# Altium schematic sheet Sheet2.SchDoc
size A4; SheetNumber: 1; SheetTotal: 2
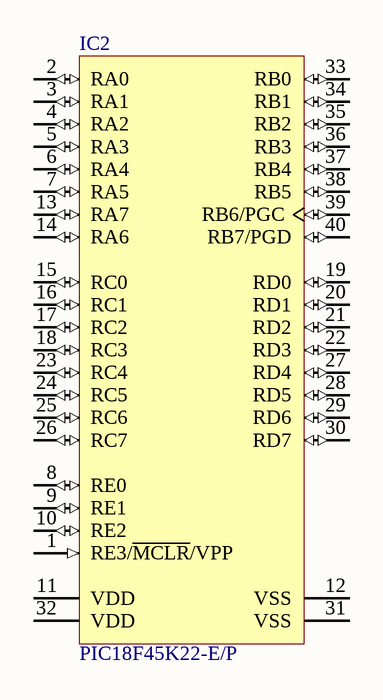
[diagram p0: Sheet2.SchDoc]

## Parts
IC2  PIC18F45K22-E/P  [MCHP-PDIP-P40]

## Nets

Not connected (* = marked no-connect by the designer): IC2 1(RE3/~{MCLR}/VPP) 2(RA0) 3(RA1) 4(RA2) 5(RA3) 6(RA4) 7(RA5) 8(RE0) 9(RE1) 10(RE2) 11(VDD) 12(VSS) 13(RA7) 14(RA6) 15(RC0) 16(RC1) 17(RC2) 18(RC3) 19(RD0) 20(RD1) 21(RD2) 22(RD3) 23(RC4) 24(RC5) 25(RC6) 26(RC7) 27(RD4) 28(RD5) 29(RD6) 30(RD7) 31(VSS) 32(VDD) 33(RB0) 34(RB1) 35(RB2) 36(RB3) 37(RB4) 38(RB5) 39(RB6/PGC) 40(RB7/PGD)

## Library data of the parts
IC2 = CMP-0116-01375-1: Low-Power, High-Performance Microcontroller with XLP Technology, 64 MHz, 35 I/O, -40 to 125 degC, 40-pin PDIP (P40), Tube; Manufacturer: Microchip; # of A/D Channels: 28; Max. CPU Speed MHz: 64; Operation Voltage Range: 2.3V - 5.5V; Timers: 3 - 8-bit, 4 - 16-bit; EEPROM Data Memory (bytes): 256; Internal Oscillator: 16 MHz, 31 kHz; Digital Communication: 2 -A/E/USART, 2 -MSSP(SPI/I2C); Memory Type: Flash; I/O Pins: 35; Program Memory KBytes: 32; RAM: 1536; Program Memory KWords: 16; ComponentLink1URL: http://ww1.microchip.com/downloads/en/DeviceDoc/41412F.pdf; ComponentLink2Description: Package Specification; Packing: TUBE; PackageReference: PDIP-P40; ComponentLink3Description: URL Link1; RoHS: TRUE; PartNumber: PIC18F45K22-E/P; DatasheetVersion: Rev. F; Mounting Technology: Through Hole; PackageVersion: C04-016B, 04/2013; PackageDescription: 40-Lead Plastic Dual In-Line Package, Body 51.75 x 13.53 mm, Pitch 2.54 mm; ComponentLink1Description: Datasheet; ComponentLink3URL: Product URL:http://www.microchip.com/datasheet/PIC18F45K22; ComponentLink2URL: http://www.microchip.com/stellent/groups/techpub_sg/documents/packagingspec/en012702.pdf